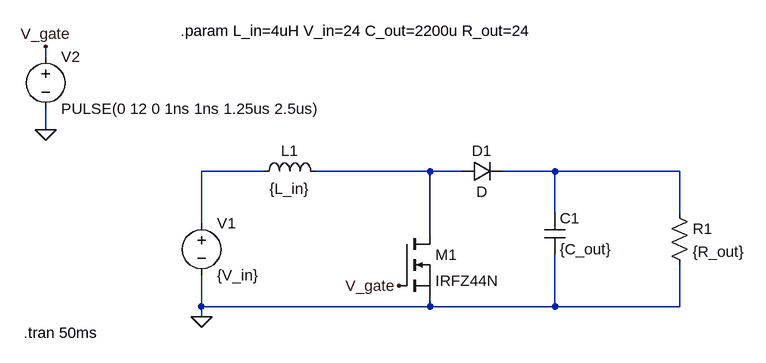
[diagram p0: schematic basic.asc]
basic.asc, the LTspice schematic file:
Version 4
SHEET 1 880 680
WIRE -240 -48 -240 -64
WIRE -240 64 -240 32
WIRE 96 128 0 128
WIRE 352 128 176 128
WIRE 400 128 352 128
WIRE 544 128 464 128
WIRE 736 128 544 128
WIRE 544 192 544 128
WIRE 736 192 736 128
WIRE 0 208 0 128
WIRE 352 224 352 128
WIRE 0 336 0 288
WIRE 352 336 352 320
WIRE 352 336 0 336
WIRE 544 336 544 256
WIRE 544 336 352 336
WIRE 736 336 736 272
WIRE 736 336 544 336
WIRE 0 352 0 336
FLAG 0 352 0
FLAG -240 64 0
FLAG -240 -64 V_gate
FLAG 304 304 V_gate
SYMBOL ind 80 144 R270
WINDOW 0 32 56 VTop 2
WINDOW 3 5 56 VBottom 2
SYMATTR InstName L1
SYMATTR Value {L_in}
SYMBOL voltage 0 192 R0
SYMATTR InstName V1
SYMATTR Value {V_in}
SYMBOL nmos 304 224 R0
SYMATTR InstName M1
SYMATTR Value IRFZ44N
SYMBOL voltage -240 -64 R0
WINDOW 123 0 0 Left 0
WINDOW 39 0 0 Left 0
SYMATTR InstName V2
SYMATTR Value PULSE(0 12 0 1ns 1ns 1.25us 2.5us)
SYMBOL diode 400 144 R270
WINDOW 0 32 32 VTop 2
WINDOW 3 0 32 VBottom 2
SYMATTR InstName D1
SYMBOL cap 528 192 R0
SYMATTR InstName C1
SYMATTR Value {C_out}
SYMBOL res 720 176 R0
SYMATTR InstName R1
SYMATTR Value {R_out}
TEXT -32 -88 Left 2 !.param L_in=4uH V_in=24 C_out=2200u R_out=24
TEXT -274 376 Left 2 !.tran 50ms

The netlist it stands for:
* basic.asc
L1 N001 N002 {L_in}
V1 N001 0 {V_in}
M1 N002 V_gate 0 0 IRFZ44N
V2 V_gate 0 PULSE(0 12 0 1ns 1ns 1.25us 2.5us)
D1 N002 N003 D
C1 N003 0 {C_out}
R1 N003 0 {R_out}
.model D D
.lib standard.dio
.model NMOS NMOS
.model PMOS PMOS
.lib standard.mos
.param L_in=4uH V_in=24 C_out=2200u R_out=24
.tran 50ms
.backanno
.end